# Altium schematic sheet USB.SchDoc: Top Level
size A3; CompanyName: NOT USED; SheetNumber: 0; SheetTotal: 0; PageSetup: Record=PageOptions|CenterHorizontal=True|CenterVertical=True|PrintScale=1.00|XCorrection=1.00|YCorrection=1.00|PrintKind=0|BorderSize=5000000|LeftOffset=0|BottomOffset=0|Orientation=2|PaperLength=1000|PaperWidth=1000|Scale=100|PaperSource=7|PrintQuality=-4|MediaType=1|DitherType=10|PaperKind=A3|PrintScaleMode=0
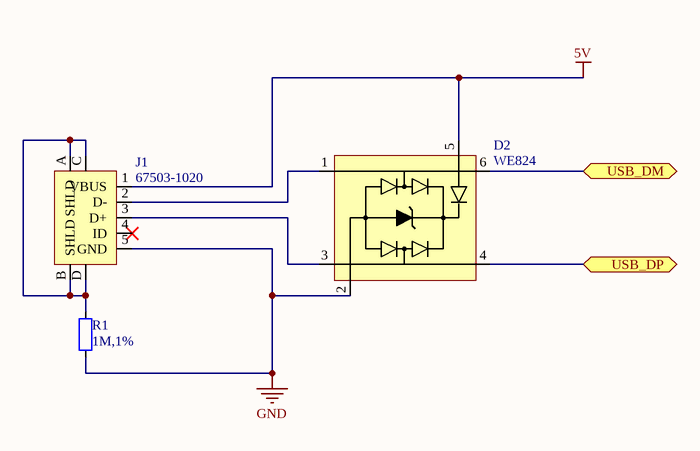
[diagram p0: USB.SchDoc]

## Parts
D2  WE824  [SOT95P280X145-6N_SOT23-6]
J1  67503-1020  [MOLEX_0675031020]
R1  1M,1%  [RESC1608X06N_0603]

## Ports
USB_DM (bidir), USB_DP (bidir)

## Nets
5V: D2.5 J1.1(VBUS)
GND: D2.2 J1.5(GND) R1.1
USB_DM: D2.6 ; port USB_DM
USB_DP: D2.4 ; port USB_DP
NetD2_1: D2.1 J1.2(D-)
NetD2_3: D2.3 J1.3(D+)
NetJ1_A: J1.A(SHLD) J1.B(SHLD) J1.C(SHLD) J1.D(SHLD) R1.2

Not connected (* = marked no-connect by the designer): J1 4(ID)*

## Notes on the sheet
- Project
- Size:
- Date:
- A3
- Revision:
- Sheet
- of
- Lambo
- File:

## Library data of the parts
D2 = DIO-10181-A: TVS DIODE 5VWM 7.7VC SOT23; Manufacturer: Wurth Electronics Inc; Manufacturer Part Number: 82400102; Vr(max): 5V; Display_Name: WE824; Type: TVS; BWA PN: DIO-10181-A; Schematic Symbol: WE824; Supplier 1: Digi-Key; Supplier Part Number 1: 732-4473-1-ND
J1 = CON-10519-A: CONN RECEPT MINIUSB R/A 5POS SMD; Manufacturer: Molex Connector Corporation; Manufacturer Part Number: 067503-1020; Contacts: 5; Pitch: 0.8; Rows: 1; Display_Name: 67503-1020; Series: 67503; Type: Receptacle; BWA PN: CON-10519-A; Schematic Symbol: MOLEX_0675031020; Supplier 1: Digi-Key; Supplier Part Number 1: WM5461CT-ND
R1 = RSH-1M000-D: RES 1.00M OHM 1/10W 1% 0603 SMD; Manufacturer: Yageo; Manufacturer Part Number: RC0603FR-071ML; Power: 0.1W; Display_Name: 1M,1%; Resistance: 1M; Tolerance: 1%; Type: Chip; BWA PN: RSH-1M000-D; Schematic Symbol: RESISTOR_1; Supplier 1: Digi-Key; Supplier Part Number 1: 311-1.00MHRCT-ND